# EAGLE design LF_mainboard (EAGLE 9.6.2)
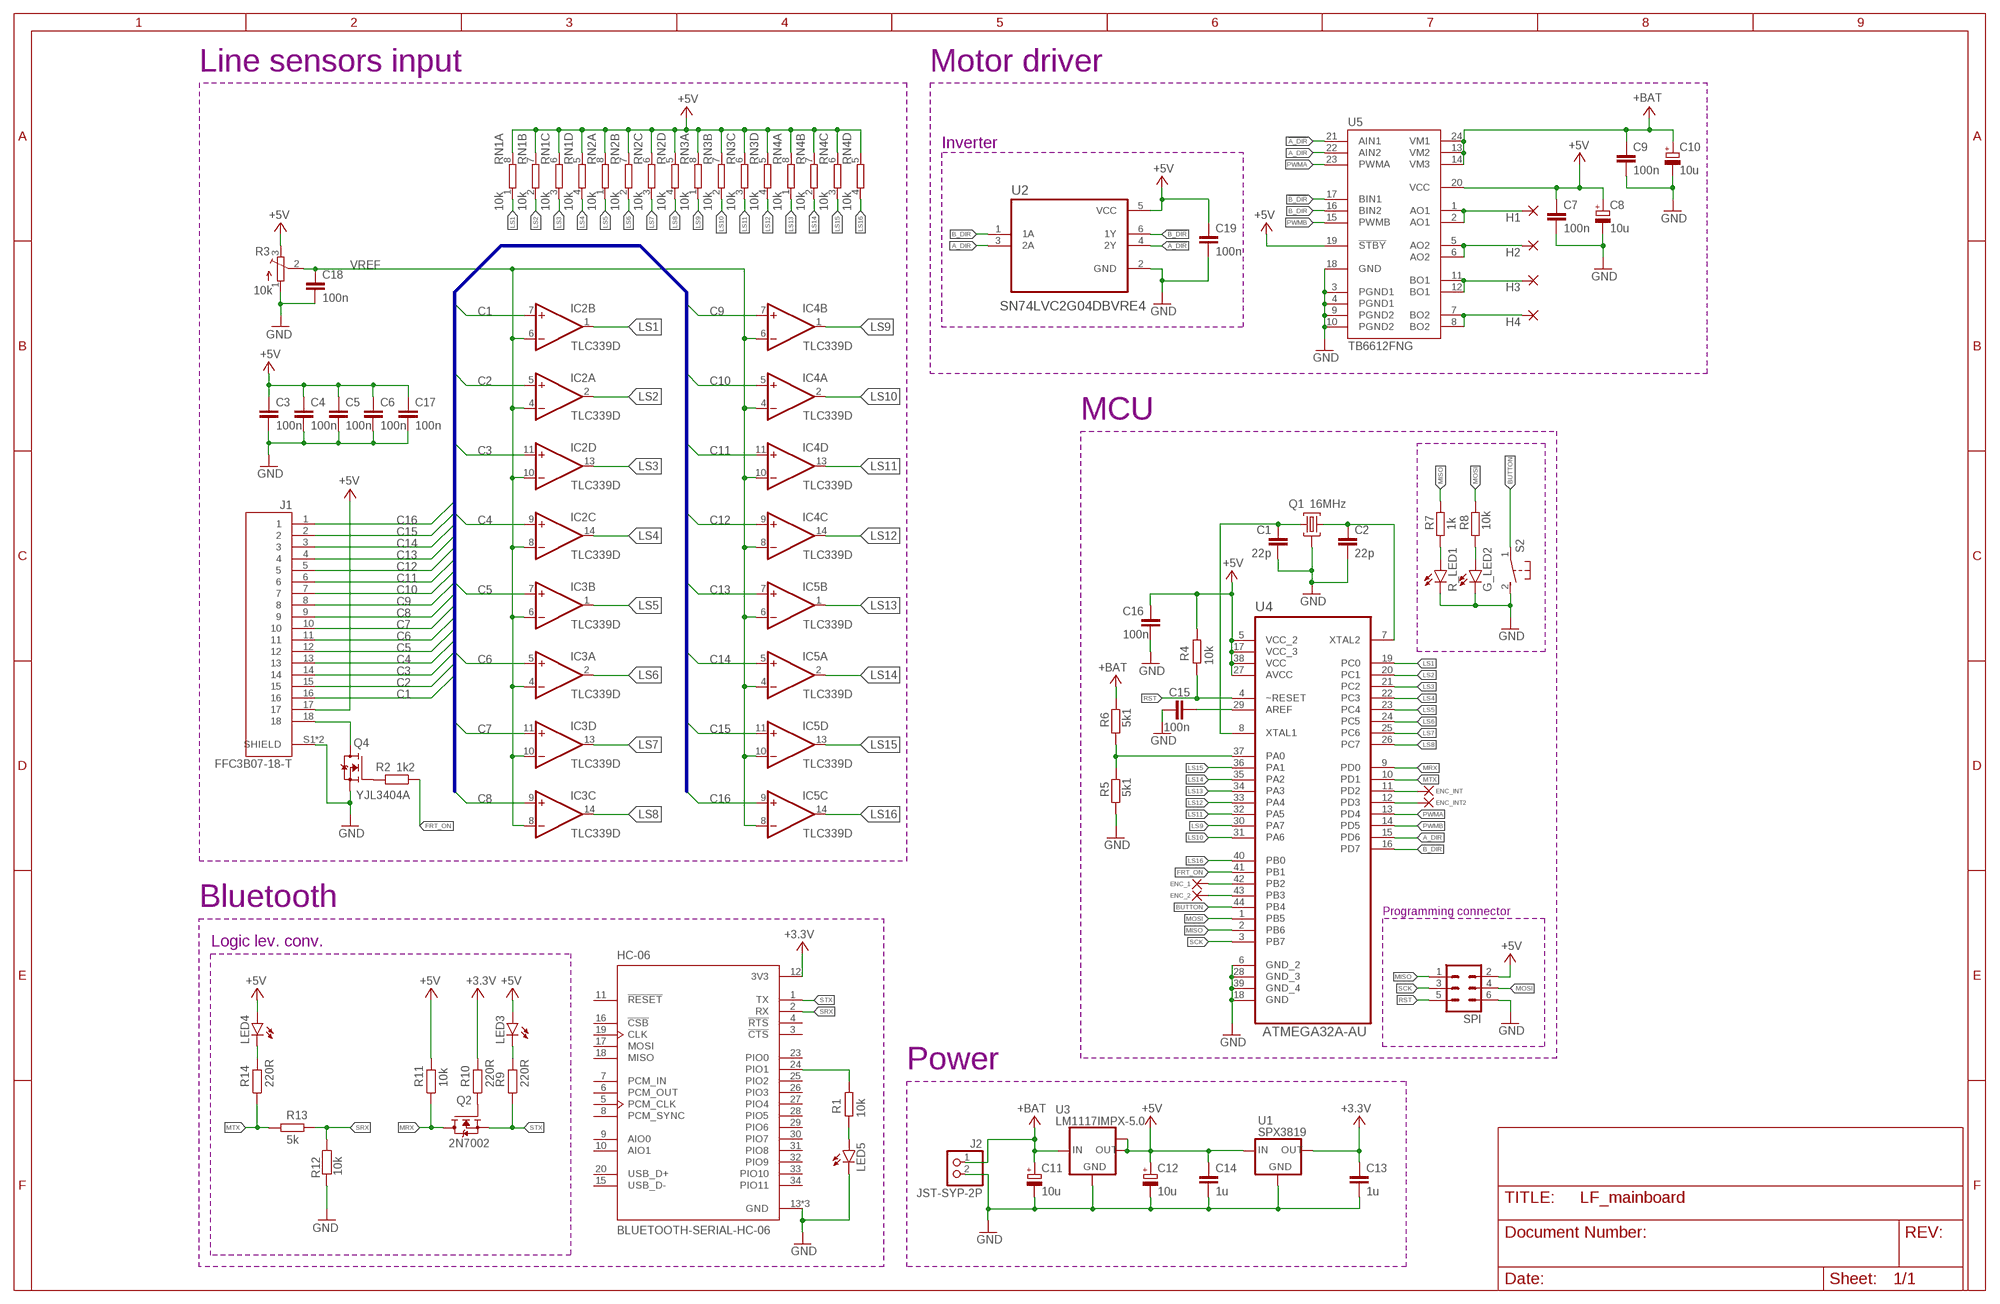
[diagram p0: schematic, sheet 1]

## Parts
C1  22p  C-EUC0603  [C0603]
C2  22p  C-EUC0603  [C0603]
C3  100n  C-EUC0603  [C0603]
C4  100n  C-EUC0603  [C0603]
C5  100n  C-EUC0603  [C0603]
C6  100n  C-EUC0603  [C0603]
C7  100n  C-EUC0603  [C0603]
C8  10u  CPOL-EUB/3528-21W  [B/3528-21W]
C9  100n  C-EUC0603  [C0603]
C10  10u  CPOL-EUB/3528-21W  [B/3528-21W]
C11  10u  CPOL-EUB/3528-21W  [B/3528-21W]
C12  10u  CPOL-EUB/3528-21W  [B/3528-21W]
C13  1u  C-EUC0805  [C0805]
C14  1u  C-EUC0805  [C0805]
C15  100n  C-EUC0603  [C0603]
C16  100n  C-EUC0402  [C0402]
C17  100n  C-EUC0603  [C0603]
C18  100n  C-EUC0402  [C0402]
C19  100n  C-EUC0402  [C0402]
ENC_2  1,6/0,8  [1,6/0,8]
G_LED2  LEDCHIP-LED0805  [CHIP-LED0805]
H1  1,6/0,8  [1,6/0,8]
H2  1,6/0,8  [1,6/0,8]
H3  1,6/0,8  [1,6/0,8]
H4  1,6/0,8  [1,6/0,8]
H5  1,6/0,8  [1,6/0,8]
H6  1,6/0,8  [1,6/0,8]
H8  1,6/0,8  [1,6/0,8]
HC-06  BLUETOOTH-SERIAL-HC-06  [XCVR_BLUETOOTH-SERIAL-HC-06]
IC2  TLC339D  [SO14]
IC3  TLC339D  [SO14]
IC4  TLC339D  [SO14]
IC5  TLC339D  [SO14]
J1  FFC3B07-18-T  [GCT_FFC3B07-18-T]
J2  JST-SYP-2P  PINHD-1X2  [1X02]
LED3  LEDCHIP-LED0805  [CHIP-LED0805]
LED4  LEDCHIP-LED0805  [CHIP-LED0805]
LED5  LEDCHIP-LED0805  [CHIP-LED0805]
Q1  16MHz  CRYSTAL_3,4X2,7  [CRYSTAL_3,4X2,7]
Q2  2N7002  [SOT95P240X111-3N]
Q4  YJL3404A  2N7002  [SOT95P240X111-3N]
R1  10k  R-EU_R0603  [R0603]
R2  1k2  R-EU_R0603  [R0603]
R3  10k  TRIM_EU-SM-42/43A  [SM-42/43A]
R4  10k  R-EU_R0402  [R0402]
R5  5k1  R-EU_R0603  [R0603]
R6  5k1  R-EU_R0603  [R0603]
R7  1k  R-EU_R0402  [R0402]
R8  10k  R-EU_R0402  [R0402]
R9  220R  R-EU_R0402  [R0402]
R10  220R  R-EU_R0402  [R0402]
R11  10k  R-EU_R0402  [R0402]
R12  10k  R-EU_R0402  [R0402]
R13  5k  R-EU_R0402  [R0402]
R14  220R  R-EU_R0402  [R0402]
R_LED1  LEDCHIP-LED0805  [CHIP-LED0805]
RN1  10k  4R-NCAT16  [CAT16]
RN2  10k  4R-NCAT16  [CAT16]
RN3  10k  4R-NCAT16  [CAT16]
RN4  10k  4R-NCAT16  [CAT16]
S2  DTSM-3  [DTSM-3]
SPI  MA03-2  [MA03-2]
U1  SPX3819  [SOT23-5]
U2  SN74LVC2G04DBVRE4  [SOT95P280X145-6N]
U3  LM1117IMPX-5.0  [SOT223]
U4  ATMEGA32A-AU  [QFP80P1200X1200X120-44N]
U5  TB6612FNG  [SSOP24]

## Nets
!A_DIR: U2.4(2Y) U5.21(AIN1)
!B_DIR: U2.6(1Y) U5.17(BIN1)
+3.3V: C13.1 HC-06.12(3V3) R10.2 U1.5(OUT) ; supply symbol labelled VCC
+5V: C3.1 C4.1 C5.1 C6.1 C7.1 C8.+ C12.+ C14.1 C16.1 C17.1 C19.1 J1.17 LED3.A LED4.A R3.3(E) R4.2 R11.2 RN1.5 RN1.6 RN1.7 RN1.8 RN2.5 RN2.6 RN2.7 RN2.8 RN3.5 RN3.6 RN3.7 RN3.8 RN4.5 RN4.6 RN4.7 RN4.8 SPI.2 U1.1(IN) U1.3(IN) U2.5(VCC) U3.2(OUT) U3.TAB(OUT1) U4.5(VCC_2) U4.17(VCC_3) U4.27(AVCC) U4.38(VCC) U5.19(!STBY) U5.20(VCC) ; supply symbol labelled VCC
+BAT: C9.1 C10.+ C11.+ J2.1 R6.2 U3.3(IN) U5.13(VM2) U5.14(VM3) U5.24(VM1) ; supply symbol labelled VCC
A_DIR: U2.3(2A) U4.15(PD6) U5.22(AIN2)
AO: H1.1(P) U5.1(AO1) U5.2(AO1)
AO2: H2.1(P) U5.5(AO2) U5.6(AO2)
AREF: C15.2 U4.29(AREF)
B_DIR: U2.1(1A) U4.16(PD7) U5.16(BIN2)
BAT_MEAS: R5.2 R6.1 U4.37(PA0)
BO1: H3.1(P) U5.11(BO1) U5.12(BO1)
BO2: H4.1(P) U5.7(BO2) U5.8(BO2)
BUTTON: S2.1 U4.44(PB4)
C1: IC2.7(B:+IN) J1.16
C2: IC2.5(A:+IN) J1.15
C3: IC2.11(D:+IN) J1.14
C4: IC2.9(C:+IN) J1.13
C5: IC3.7(B:+IN) J1.12
C6: IC3.5(A:+IN) J1.11
C7: IC3.11(D:+IN) J1.10
C8: IC3.9(C:+IN) J1.9
C9: IC4.7(B:+IN) J1.8
C10: IC4.5(A:+IN) J1.7
C11: IC4.11(D:+IN) J1.6
C12: IC4.9(C:+IN) J1.5
C13: IC5.7(B:+IN) J1.4
C14: IC5.5(A:+IN) J1.3
C15: IC5.11(D:+IN) J1.2
C16: IC5.9(C:+IN) J1.1
ENC_1: H8.1(P) U4.42(PB2)
ENC_2: ENC_2.1(P) U4.43(PB3)
ENC_INT: H5.1(P) U4.11(PD2)
ENC_INT2: H6.1(P) U4.12(PD3)
FRT_ON: R2.1 U4.41(PB1)
GND: C1.2 C2.2 C3.2 C4.2 C5.2 C6.2 C7.2 C8.- C9.2 C10.- C11.- C12.- C13.2 C14.2 C15.1 C16.2 C17.2 C18.2 C19.2 G_LED2.C HC-06.13(GND) HC-06.21(GND) HC-06.22(GND) J1.S1(SHIELD) J1.S2(SHIELD) J2.2 LED5.C Q1.GND Q1.GND2 Q4.2(S) R3.1(A) R5.1 R12.2 R_LED1.C S2.2 SPI.6 U1.2(GND) U2.2(GND) U3.1(GND) U4.6(GND_2) U4.18(GND) U4.28(GND_3) U4.39(GND_4) U5.3(PGND1) U5.4(PGND1) U5.9(PGND2) U5.10(PGND2) U5.18(GND)
LED1: R7.1 R_LED1.A
LED2: G_LED2.A R8.1
LS1: IC2.1(B:OUT) RN1.1 U4.19(PC0)
LS2: IC2.2(A:OUT) RN1.2 U4.20(PC1)
LS3: IC2.13(D:OUT) RN1.3 U4.21(PC2)
LS4: IC2.14(C:OUT) RN1.4 U4.22(PC3)
LS5: IC3.1(B:OUT) RN2.1 U4.23(PC4)
LS6: IC3.2(A:OUT) RN2.2 U4.24(PC5)
LS7: IC3.13(D:OUT) RN2.3 U4.25(PC6)
LS8: IC3.14(C:OUT) RN2.4 U4.26(PC7)
LS9: IC4.1(B:OUT) RN3.1 U4.30(PA7)
LS10: IC4.2(A:OUT) RN3.2 U4.31(PA6)
LS11: IC4.13(D:OUT) RN3.3 U4.32(PA5)
LS12: IC4.14(C:OUT) RN3.4 U4.33(PA4)
LS13: IC5.1(B:OUT) RN4.1 U4.34(PA3)
LS14: IC5.2(A:OUT) RN4.2 U4.35(PA2)
LS15: IC5.13(D:OUT) RN4.3 U4.36(PA1)
LS16: IC5.14(C:OUT) RN4.4 U4.40(PB0)
MISO: R7.2 SPI.1 U4.2(PB6)
MOSI: R8.2 SPI.4 U4.1(PB5)
MRX: Q2.3(D) R11.1 U4.9(PD0)
MTX: R13.1 R14.1 U4.10(PD1)
N$1: C1.1 Q1.CRST1 U4.8(XTAL1)
N$2: C2.1 Q1.CRST2 U4.7(XTAL2)
N$4: J1.18 Q4.3(D)
N$7: Q4.1(G) R2.2
N$8: HC-06.24(PIO1) R1.2
N$9: Q2.1(G) R10.1
N$10: LED4.C R14.2
N$11: LED3.C R9.2
N$12: LED5.A R1.1
PWMA: U4.13(PD4) U5.23(PWMA)
PWMB: U4.14(PD5) U5.15(PWMB)
RST: R4.1 SPI.5 U4.4(~RESET)
SCK: SPI.3 U4.3(PB7)
SRX: HC-06.2(RX) R12.1 R13.2
STX: HC-06.1(TX) Q2.2(S) R9.1
VREF: C18.1 IC2.4(A:-IN) IC2.6(B:-IN) IC2.8(C:-IN) IC2.10(D:-IN) IC3.4(A:-IN) IC3.6(B:-IN) IC3.8(C:-IN) IC3.10(D:-IN) IC4.4(A:-IN) IC4.6(B:-IN) IC4.8(C:-IN) IC4.10(D:-IN) IC5.4(A:-IN) IC5.6(B:-IN) IC5.8(C:-IN) IC5.10(D:-IN) R3.2(S)
Unconnected: HC-06.3(!CTS) HC-06.4(!RTS) HC-06.5(PCM_CLK) HC-06.6(PCM_OUT) HC-06.7(PCM_IN) HC-06.8(PCM_SYNC) HC-06.9(AIO0) HC-06.10(AIO1) HC-06.11(!RESET) HC-06.15(USB_D-) HC-06.16(!CSB) HC-06.17(MOSI) HC-06.18(MISO) HC-06.19(CLK) HC-06.20(USB_D+) HC-06.23(PIO0) HC-06.25(PIO2) HC-06.26(PIO3) HC-06.27(PIO4) HC-06.28(PIO5) HC-06.29(PIO6) HC-06.30(PIO7) HC-06.31(PIO8) HC-06.32(PIO9) HC-06.33(PIO10) HC-06.34(PIO11)

## Buses
C[1..16]

## Notes on the sheet
- Line sensors input | Motor driver
- Inverter
- MCU
- Bluetooth
- Programming connector
- Logic lev. conv.
- Power

## Power pins joined to a net without a drawn wire
+5V: IC2.3(P:V+) IC3.3(P:V+) IC4.3(P:V+) IC5.3(P:V+)
GND: IC2.12(P:V-) IC3.12(P:V-) IC4.12(P:V-) IC5.12(P:V-)

## Library data of the parts
C1-C7 C9 C13-C19 = rcl:C-EU: CAPACITOR, European symbol; SPICEPREFIX: C
C8 C10-C12 = rcl:CPOL-EU: POLARIZED CAPACITOR, European symbol; SPICEPREFIX: C
ENC_2 H1-H6 H8 = wirepad:1,6/0,8: THROUGH-HOLE PAD
G_LED2 LED3-LED5 R_LED1 = led:LED: LED OSRAM: - CHIPLED LG R971, LG N971, LY N971, LG Q971, LY Q971, LO R971, LY R971 LH N974, LH R974 LS Q976, LO Q976, LY Q976 LO Q996 - Hyper CHIPLED LW Q18S LB Q993, LB Q99A, LB R99A - SideLED LS A670, LO A670, LY A670, LG A670, LP A670 LB A673, LV A673, LT A673, LW A673 LH A674 LY A675 LS A676, LA A676, LO A676, LY A676, LW A676 LS A679, LY A679, LG A679 - Hyper Micro SIDELED® LS Y876, LA Y876, LO Y876, LY Y876 LT Y87S - SmartLED LW L88C, LW L88S LB L89C, LB L89S, LG L890 LS L89K, LO L89K, LY L89K LS L896, LA L896, LO L896, LY L896 - TOPLED LS T670, LO T670, LY T670, LG T670, LP T670 LSG T670, LSP T670, LSY T670, LOP T670, LYG T670 LG T671, LOG T671, LSG T671 LB T673, LV T673, LT T673, LW T673 LH T674 LS T676, LA T676, LO T676, LY T676, LB T676, LH T676, LSB T676, LW T676 LB T67C, LV T67C, LT T67C, LS T67K, LO T67K, LY T67K, LW E67C LS E67B, LA E67B, LO E67B, LY E67B, LB E67C, LV E67C, LT E67C LW T67C LS T679, LY T679, LG T679 LS T770, LO T770, LY T770, LG T770, LP T770 LB T773, LV T773, LT T773, LW T773 LH T774 LS E675, LA E675, LY E675, LS T675 LS T776, LA T776, LO T776, LY T776, LB T776 LHGB T686 LT T68C, LB T68C - Hyper Mini TOPLED® LB M676 - Mini TOPLED Santana® LG M470 LS M47K, LO M47K, LY M47K Source: http://www.osram.convergy.de LUXEON: - LUMILED® LXK2-PW12-R00, LXK2-PW12-S00, LXK2-PW14-U00, LXK2-PW14-V00 LXK2-PM12-R00, LXK2-PM12-S00, LXK2-PM14-U00 LXK2-PE12-Q00, LXK2-PE12-R00, LXK2-PE12-S00, LXK2-PE14-T00, LXK2-PE14-U00 LXK2-PB12-K00, LXK2-PB12-L00, LXK2-PB12-M00, LXK2-PB14-N00, LXK2-PB14-P00, LXK2-PB14-Q00 LXK2-PR12-L00, LXK2-PR12-M00, LXK2-PR14-Q00, LXK2-PR14-R00 LXK2-PD12-Q00, LXK2-PD12-R00, LXK2-PD12-S00 LXK2-PH12-R00, LXK2-PH12-S00 LXK2-PL12-P00, LXK2-PL12-Q00, LXK2-PL12-R00 Source: www.luxeon.com KINGBRIGHT: KA-3528ASYC Source: www.kingbright.com
HC-06 = BLUETOOTH-SERIAL-HC-06:BLUETOOTH-SERIAL-HC-06: Bluetooth Modules (802.15.1) BLUETOOTH-SERIAL-HC-06 Check availability <https://pricing.snapeda.com/parts/BLUETOOTH-SERIAL-HC-06/Olimex/view-part?ref=eda>; AVAILABILITY: In Stock; DESCRIPTION: Bluetooth Modules (802.15.1) BLUETOOTH-SERIAL-HC-06; MF: Olimex; MP: BLUETOOTH-SERIAL-HC-06; PACKAGE: None; PRICE: None; PURCHASE-URL: https://pricing.snapeda.com/search/part/BLUETOOTH-SERIAL-HC-06/?ref=eda
IC2-IC5 = linear:TLC339: COMPARATOR
J1 = FFC18T_1mm:FFC3B07-18-T: FPC 1.0mm Pitch, Side entry, Top contact, SMT, Height 2.5mm, Slide type; MANUFACTURER: GCT; MAXIMUM_PACKAGE_HEIGHT: 2.5mm; PARTREV: A; STANDARD: Manufacturer Recommendations
J2 = pinhead:PINHD-1X2: PIN HEADER
Q1 = CRYSTAL_SMD_3,4x2.7mm:CRYSTAL_3,4X2,7
Q2 Q4 = 2N7002:2N7002: N-Channel 60V 280mA (Ta) 350mW (Ta) Surface Mount SOT-23-3 (TO-236) Check availability <https://pricing.snapeda.com/parts/2N7002/ON%20Semiconductor/view-part?ref=eda>; AVAILABILITY: In Stock; DESCRIPTION: N-Channel 60V 280mA (Ta) 350mW (Ta) Surface Mount SOT-23-3 (TO-236); MF: ON Semiconductor; MP: 2N7002; PACKAGE: SOT-23-3 ON Semiconductor; PRICE: None; PURCHASE-URL: https://pricing.snapeda.com/search/part/2N7002/?ref=eda
R1 R2 R4-R14 = rcl:R-EU_: RESISTOR, European symbol; SPICEPREFIX: R
R3 = pot:TRIM_EU-: POTENTIOMETER
RN1-RN4 = resistor-dil:4R-N: Array Chip Resistor Source: RS Component / Phycomp; OC_FARNELL: unknown; OC_NEWARK: unknown
S2 = switch-tact:DTSM-3
SPI = con-lstb:MA03-2: PIN HEADER; OC_FARNELL: unknown; OC_NEWARK: unknown
U1 = SPX3819:SPX3819: Check availability <https://pricing.snapeda.com/parts/SPX3819/MaxLinear%2C%20Inc./view-part?ref=eda>; AVAILABILITY: In Stock; DESCRIPTION: Linear Voltage Regulator IC Positive Adjustable 1 Output 500mA 8-DFN (2x3); MF: MaxLinear, Inc.; MP: SPX3819; PACKAGE: SOT-23-5 Exar; PRICE: None; PURCHASE-URL: https://pricing.snapeda.com/search/part/SPX3819/?ref=eda
U2 = SN74LVC2G04DBVRE4:SN74LVC2G04DBVRE4: Check availability <https://pricing.snapeda.com/parts/SN74LVC2G04DBVRE4/Texas%20Instruments/view-part?ref=eda>; AVAILABILITY: In Stock; CHECK_PRICES: https://www.snapeda.com/parts/SN74LVC2G04DBVRE4/Texas+Instruments/view-part/?ref=eda; DESCRIPTION: Dual Inverter 6-SOT-23 -40 to 125; MF: Texas Instruments; MP: SN74LVC2G04DBVRE4; PACKAGE: SOT-23-6 Texas Instruments; PRICE: None; PURCHASE-URL: https://www.snapeda.com/api/url_track_click_mouser/?unipart_id=1202060&manufacturer=Texas Instruments&part_name=SN74LVC2G04DBVRE4&search_term=sn74lvc2g04; SNAPEDA_LINK: https://www.snapeda.com/parts/SN74LVC2G04DBVRE4/Texas+Instruments/view-part/?ref=snap
U3 = lm1117:LM1117IMPX-*
U4 = ATMEGA32A-AU:ATMEGA32A-AU: 8-bit Microcontroller Check availability <https://pricing.snapeda.com/parts/ATMEGA32A-AU/Microchip%20Technology/view-part?ref=eda>; AVAILABILITY: In Stock; DESCRIPTION: AVR AVR® ATmega Microcontroller IC 8-Bit 16MHz 32KB (16K x 16) FLASH 44-TQFP (10x10); MF: Microchip Technology; MP: ATMEGA32A-AU; PACKAGE: TQFP-44 Microchip; PRICE: None; PURCHASE-URL: https://pricing.snapeda.com/search/part/ATMEGA32A-AU/?ref=eda
U5 = tb6612:TB6612FNG

## Board
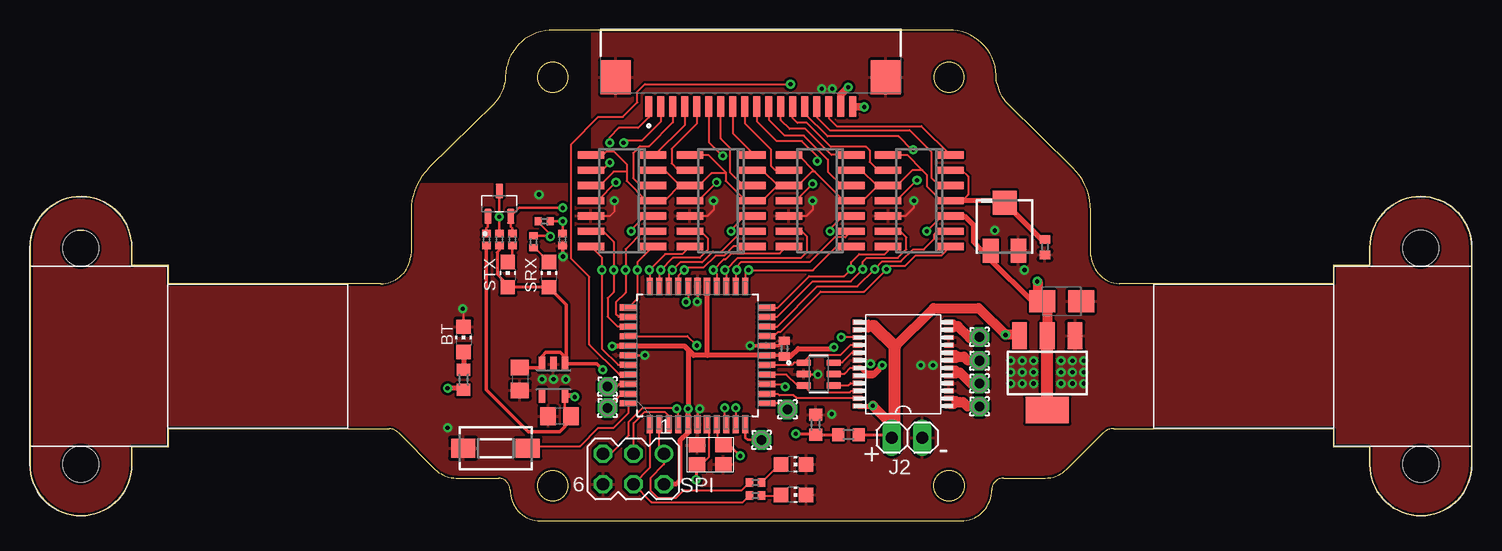
[diagram p1: board, top side]
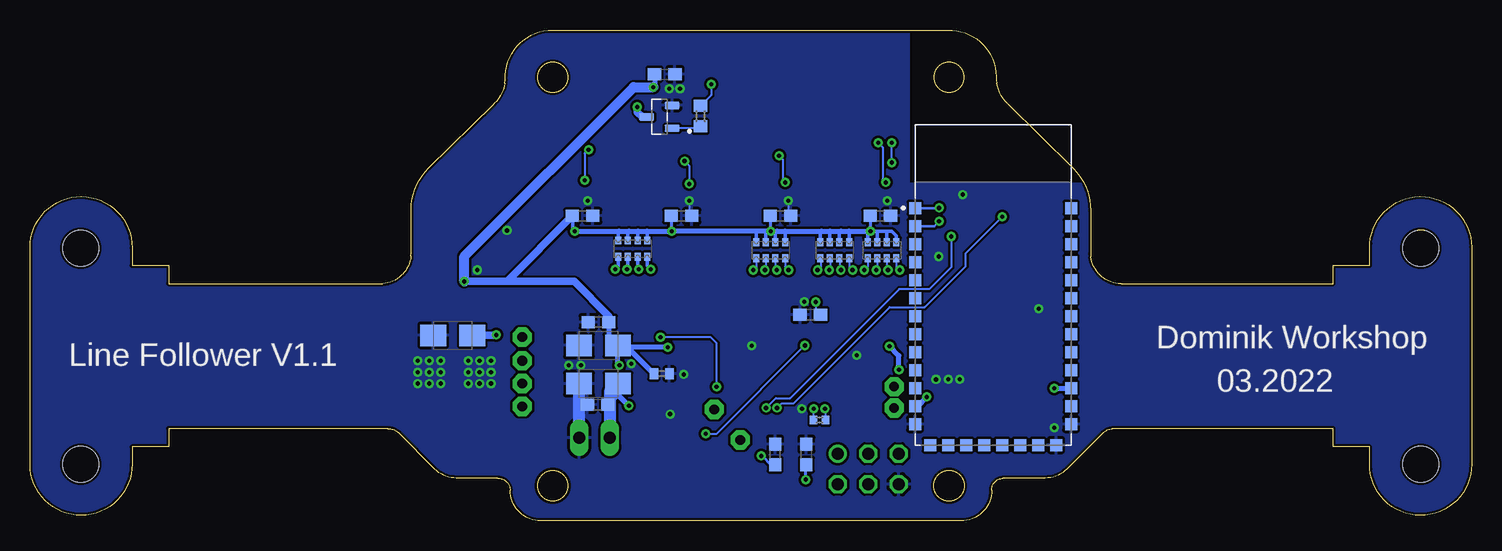
[diagram p2: board, bottom side, seen from below]

Size 120.14 x 40.89 mm. Coordinates in mm from the lower left corner, seen from the top.
Outline: 3.97,24.19 4.08,24.21 4.18,24.22 4.29,24.22 4.4,24.21 4.5,24.19
Outline: 29.22,19.75 11.56,19.75 11.56,21.27 8.51,21.27 8.51,22.73 8.5,23.1 arc175 0,22.8 0,4.7 arc175 8.49,4.33 8.51,4.7 8.51,6.16 11.56,6.16 11.56,7.68 29.83,7.68 29.94,7.68 arc-40 30.72,7.31 33.74,4.3 arc45 35.53,3.56 38.99,3.56 39.08,3.55 arc-85 40,2.54 40.02,2.32 arc85 42.55,0 77.6,0 77.82,0.01 arc80 80.13,2.32 80.14,2.54 arc-90 81.15,3.56 84.61,3.56 84.83,3.57 arc40 86.41,4.3 89.42,7.31 89.5,7.39 arc-40 90.31,7.68 108.59,7.68 108.59,6.16 111.63,6.16 111.63,4.7 111.65,4.33 arc175 120.14,4.7 120.14,22.8 120.12,23.17 arc175 111.63,22.73 111.63,21.27 108.59,21.27 108.59,19.75 90.92,19.75 90.76,19.75 arc-45 89.04,20.6 89.02,20.63 88.98,20.67 arc-35 88.4,22.06 88.39,22.28 88.39,25.84 arc45 86.9,29.41 81.47,34.75 81.45,34.77 arc-35 80.57,36.47 80.53,36.74 arc93 76.58,40.89 43.56,40.89 43.28,40.88 arc85 39.62,37.02 39.62,36.99 39.61,36.72 39.57,36.44 arc-35 38.67,34.75 33.24,29.41 33.21,29.38 arc45 31.75,25.84 31.75,22.28 31.75,22.22 31.73,22 arc-35 31.13,20.63 31.1,20.6 30.99,20.48 arc-45 29.22,19.75
Outline: circle at 43.56,2.92 radius 1.27
Outline: circle at 76.58,2.92 radius 1.27
Outline: circle at 76.58,36.96 radius 1.25
Outline: circle at 43.56,36.96 radius 1.25
Copper layers (1*16): Top 0.035mm / dielectric 1.5mm / Bottom 0.035mm
Design rules "default *": minimum track width 6mil, minimum drill 0.35mm, track to track 6mil, track to pad 6mil, pad to pad 6mil, via to via 6mil, smd to smd 6mil, copper to edge 4mil, drill to drill 6mil, minimum pad ring 10mil, minimum via ring 8mil, stop-mask expansion 4mil, vias tented up to drill 14mil, thermal gap 10mil

### Footprints (pad centres in the part's own frame; a part is rotated, then mirrored left to right if it is on the bottom)
C0603 = smd 1.1 x 1: 1 -0.85,0; 2 0.85,0
B/3528-21W = smd 2.15 x 1.8: + 1.625,0; - -1.625,0
C0805 = smd 1.3 x 1.5: 1 -0.95,0; 2 0.95,0
C0402 = smd 0.7 x 0.9: 1 -0.65,0; 2 0.65,0
1,6/0,8 = drill 0.813 pad 1.6 octagon: 1 0,0
CHIP-LED0805 = smd 1.2 x 1.2: A 0,-1.05; C 0,1.05
XCVR_BLUETOOTH-SERIAL-HC-06 = smd 1 x 1: 1 -6.5,6.5; 2 -6.5,5; 3 -6.5,3.5; 4 -6.5,2; 5 -6.5,0.5; 6 -6.5,-1; 7 -6.5,-2.5; 8 -6.5,-4; 9 -6.5,-5.5; 10 -6.5,-7; 11 -6.5,-8.5; 12 -6.5,-10; 13 -6.5,-11.5; 14 -5.25,-13.25; 15 -3.75,-13.25; 16 -2.25,-13.25; 17 -0.75,-13.25; 18 0.75,-13.25; 19 2.25,-13.25; 20 3.75,-13.25; 21 5.25,-13.25; 22 6.5,-11.5; 23 6.5,-10; 24 6.5,-8.5; 25 6.5,-7; 26 6.5,-5.5; 27 6.5,-4; 28 6.5,-2.5; 29 6.5,-1; 30 6.5,0.5; 31 6.5,2; 32 6.5,3.5; 33 6.5,5; 34 6.5,6.5
SO14 = smd 0.6 x 2.2: 1 -3.81,-2.6; 2 -2.54,-2.6; 3 -1.27,-2.6; 4 0,-2.6; 5 1.27,-2.6; 6 2.54,-2.6; 7 3.81,-2.6; 8 3.81,2.6; 9 2.54,2.6; 10 1.27,2.6; 11 0,2.6; 12 -1.27,2.6; 13 -2.54,2.6; 14 -3.81,2.6
GCT_FFC3B07-18-T = smd 0.6 x 1.7: 1 8.5,2.45; 2 7.5,2.45; 3 6.5,2.45; 4 5.5,2.45; 5 4.5,2.45; 6 3.5,2.45; 7 2.5,2.45; 8 1.5,2.45; 9 0.5,2.45; 10 -0.5,2.45; 11 -1.5,2.45; 12 -2.5,2.45; 13 -3.5,2.45; 14 -4.5,2.45; 15 -5.5,2.45; 16 -6.5,2.45; 17 -7.5,2.45; 18 -8.5,2.45 | smd 2.5 x 2.8: S1 11.25,0; S2 -11.25,0
1X02 = drill 1.016 long: 1 -1.27,0; 2 1.27,0
CRYSTAL_3,4X2,7 = smd 1.4 x 1.15: CRST1 0,-1.6; CRST2 2.2,0; GND 0,0; GND2 2.2,-1.6
SOT95P240X111-3N = smd 1.23 x 0.6: 1 -1.06,0.95; 2 -1.06,-0.95; 3 1.06,0
R0603 = smd 1 x 1.1: 1 -0.85,0; 2 0.85,0
SM-42/43A = smd 2 x 1.3: 1 2,1.15; 3 2,-1.15 | smd 2 x 2: 2 -2,0
R0402 = smd 0.6 x 0.7: 1 -0.5,0; 2 0.5,0
CAT16 = smd 0.5 x 0.65: 1 -1.2,-0.675; 2 -0.4,-0.675; 3 0.4,-0.675; 4 1.2,-0.675; 5 1.2,0.675; 6 0.4,0.675; 7 -0.4,0.675; 8 -1.2,0.675
DTSM-3 = smd 2 x 1.6: 1 -2.7,0; 2 2.7,0
MA03-2 = drill 1.016: 1 -2.54,-1.27 | drill 1.016 octagon: 2 -2.54,1.27; 3 0,-1.27; 4 0,1.27; 5 2.54,-1.27; 6 2.54,1.27
SOT23-5 = smd 1.2 x 0.55: 1 1.3,-0.95; 2 1.3,0; 3 1.3,0.95; 4 -1.3,0.95; 5 -1.3,-0.95
SOT95P280X145-6N = smd 1.21 x 0.58: 1 -1.255,0.95; 2 -1.255,0; 3 -1.255,-0.95; 4 1.255,-0.95; 5 1.255,0; 6 1.255,0.95
SOT223 = smd 1.219 x 2.235: 1 -2.311,-3.099; 2 0,-3.099; 3 2.311,-3.099 | smd 3.6 x 2.2: TAB 0,3.099
QFP80P1200X1200X120-44N = smd 1.473 x 0.508: 1 -5.74,3.988; 2 -5.74,3.2; 3 -5.74,2.388; 4 -5.74,1.6; 5 -5.74,0.787; 6 -5.74,0; 7 -5.74,-0.787; 8 -5.74,-1.6; 9 -5.74,-2.388; 10 -5.74,-3.2; 11 -5.74,-3.988; 23 5.74,-3.988; 24 5.74,-3.2; 25 5.74,-2.388; 26 5.74,-1.6; 27 5.74,-0.787; 28 5.74,0; 29 5.74,0.787; 30 5.74,1.6; 31 5.74,2.388; 32 5.74,3.2; 33 5.74,3.988 | smd 0.508 x 1.473: 12 -3.988,-5.74; 13 -3.2,-5.74; 14 -2.388,-5.74; 15 -1.6,-5.74; 16 -0.787,-5.74; 17 0,-5.74; 18 0.787,-5.74; 19 1.6,-5.74; 20 2.388,-5.74; 21 3.2,-5.74; 22 3.988,-5.74; 34 3.988,5.74; 35 3.2,5.74; 36 2.388,5.74; 37 1.6,5.74; 38 0.787,5.74; 39 0,5.74; 40 -0.787,5.74; 41 -1.6,5.74; 42 -2.388,5.74; 43 -3.2,5.74; 44 -3.988,5.74
SSOP24 = smd 0.406 x 0.762: 1 -3.651,-3.81; 2 -3.016,-3.81; 3 -2.381,-3.81; 4 -1.746,-3.81; 5 -1.111,-3.81; 6 -0.476,-3.81; 7 0.159,-3.81; 8 0.794,-3.81; 9 1.429,-3.81; 10 2.064,-3.81; 11 2.699,-3.81; 12 3.334,-3.81; 13 3.334,3.81; 14 2.699,3.81; 15 2.064,3.81; 16 1.429,3.81; 17 0.794,3.81; 18 0.159,3.81; 19 -0.476,3.81; 20 -1.111,3.81; 21 -1.746,3.81; 22 -2.381,3.81; 23 -3.016,3.81; 24 -3.651,3.81
HP_NM = hole 3: -9,-3; 9,-3

### Placement (x,y rotation side)
C1  58.04,5.52 90 bottom
C2  55.44,5.52 90 bottom
C3  49.28,25.4 0 bottom
C4  57.59,25.4 0 bottom
C5  65.85,25.4 0 bottom
C6  74.1,25.4 0 bottom
C7  72.77,16.54 180 bottom
C8  72.77,14.6 0 bottom
C9  72.83,9.65 180 bottom
C10  72.77,11.43 0 bottom
C11  84.91,15.44 0 bottom
C12  85.98,18.29 180 top
C13  44.13,8.7 180 top
C14  40.83,11.81 270 top
C15  55.12,17.18 0 bottom
C16  62.86,14.35 90 top
C17  67.25,37.21 0 bottom
C18  84.58,22.8 270 top
C19  67.5,12.26 0 bottom
ENC_2  48.13,9.4 0 top
G_LED2  63.63,2.16 270 top
H1  79.12,9.52 0 top
H2  79.12,11.43 0 top
H3  79.12,15.3 0 top
H4  79.12,13.33 0 top
H5  60.96,6.73 0 top
H6  63.12,9.27 0 top
H8  48.13,11.18 0 top
HC-06  39.88,19.56 0 bottom
IC2  74.1,26.67 90 top
IC3  65.85,26.67 90 top
IC4  57.59,26.67 90 top
IC5  49.34,26.67 90 top
J1  60.07,36.96 180 top
J2  73.09,6.92 0 top
LED3  39.81,20.51 0 top
LED4  43.24,20.51 0 top
LED5  36.13,15.11 0 top
Q1  57.78,4.7 180 top
Q2  39.12,26.42 90 top
Q4  67.69,33.66 180 bottom
R1  36.13,11.75 270 top
R2  64.26,33.72 270 bottom
R3  81.22,24.51 270 top
R4  54.36,8.38 180 bottom
R5  65.47,8 270 top
R6  68.21,7.18 0 top
R7  60.45,3.17 180 top
R8  60.45,2.1 180 top
R9  40.2,23.43 270 top
R10  38.04,23.43 270 top
R11  39.12,23.43 270 top
R12  44.39,23.43 270 top
R13  42.86,24.96 0 top
R14  41.97,23.24 270 top
R_LED1  63.63,4.7 270 top
RN1  69.91,22.67 0 bottom
RN2  58.42,22.54 0 bottom
RN3  53.09,22.54 0 bottom
RN4  49.15,22.54 0 bottom
S2  38.8,6.03 180 top
SPI  50.29,4.32 180 top
U1  43.62,11.75 90 top
U2  65.72,12.22 0 top
U3  84.77,12.32 180 top
U4  55.63,13.78 90 top
U5  72.77,13.21 90 top
U$1  [HP_NM]  112.9,13.72 90 top
U$2  [HP_NM]  7.24,13.72 270 top

### Tracks (layer width: path | path; a pad name or v marks a point on that pad's centre or on a via)
!A_DIR
  Top 0.152: U5.21 68.39,11.47 68.2,11.27 U2.4
!B_DIR
  Top 0.152: U5.17 68.5,14 67.7,13.21 67.01,13.21 U2.6
+3.3V  (via drill 0.35)
  Top 0.203: U1.5 44.57,10.41 44.57,9.21 C13.1
  Top 0.305: R10.2 38.04,10.92 41.53,7.43 44.13,7.43 45.08,8.38 C13.1
  Top 0.406: v45.4,10.32 45.31,10.41 44.57,10.41
  Bottom 0.406: HC-06.12 46.12,9.56 45.4,10.28 v45.4,10.32
+5V  (via drill 0.35, 0.35 pad 0.25)
  Top 0.152: IC5.3 51.24,25.4 50.1,24.26 v50.1,24.13 | IC4.3 59.56,25.4 58.42,24.26 v58.42,24.13 | IC3.3 67.75,25.4 66.67,24.32 v66.67,24.13 | IC2.3 76.01,25.4 v74.74,24.13 | LED3.A 39.81,19.65 | 62.79,13.78 C16.1 | U5.19 68.36,12.73 67.88,12.26 67.56,12.26 67.4,12.26 67.01,12.26 U2.5
  Top 0.254: 39.81,19.65 38.93,20.54 38.93,22.36 39.12,22.55 R11.2 | LED4.A LED3.A
  Top 0.305: U4.17 62.79,13.78 | v47.73,12.57 47.22,13.08 44.7,13.08 | 44.7,13.08 44.61,13.08 U1.1 44.57,13.65 44.2,14.03 42.99,14.03 42.67,13.72 U1.3 42.39,12.76 C14.1 | LED4.A 44.7,18 44.7,13.08
  Top 0.406: C12.+ 83.5,18.29 80.07,21.72 R3.3 79.37,22.51 78.61,23.27 78.61,24.64 77.85,25.4 IC2.3 | U5.20 70.29,12.1 70.77,12.57 70.77,12.7 v71.02,12.95 70.35,12.29 69.72,12.29 69.28,12.73 U5.19 | SPI.2 53.85,3.05 54.17,3.36 54.17,6.67 54.84,7.34 U4.5 v54.84,9.33 54.84,14.25 | C16.1 63.36,13.7 64.01,14.35 66.99,14.35 v66.99,14.45 | v48.51,14.54 48.54,14.57 U4.38 54.52,14.57 54.84,14.25 | 54.84,14.25 55.31,13.78 56.45,13.78 | U4.17 56.45,13.78 | U4.27 56.41,13.82 56.45,13.78
  Top 0.61: J1.17 67.57,35.5 v68.2,36.13
  Top 0.813: U3.2 84.77,17.87 C12.+ 83.97,18.67 83.97,19.91 v83.95,19.94
  Top 1.016: U3.TAB U3.2
  Bottom 0.152: 58.44,24.13 v58.42,24.13 | v54.84,9.33 54.86,9.32 R4.2
  Bottom 0.254: C3.1 50.13,24.51 50.1,24.49 v50.1,24.13 | C4.1 58.44,24.13 | v66.67,24.13 66.7,24.15 C5.1
  Bottom 0.305: v74.74,24.13 74.93,24.32 74.93,25.38 C6.1 | RN4.5 47.95,23.76 48.32,24.13 48.83,24.13 | 48.83,24.13 49.59,24.13 | 49.59,24.13 v50.1,24.13 | RN4.6 48.75,24.05 48.83,24.13 | RN4.7 49.55,24.09 49.59,24.13 | RN4.8 50.35,24.07 50.29,24.13 | RN3.5 51.89,24.12 51.88,24.13 | RN3.6 52.69,24.02 52.58,24.13 | RN3.7 53.49,24.11 53.47,24.13 | RN3.8 54.29,24.01 54.17,24.13 | RN2.5 57.22,24.12 57.21,24.13 | RN2.6 58.02,24.02 57.91,24.13 | RN2.7 58.82,24.11 58.8,24.13 | RN2.8 59.62,24.12 59.63,24.13 | RN1.5 68.71,24.12 68.71,24.13 | RN1.6 69.51,24.09 69.47,24.13 | RN1.7 70.31,24.05 70.23,24.13 | RN1.8 71.11,24.07 71.06,24.13
  Bottom 0.406: v50.1,24.13 50.29,24.13 51.88,24.13 52.58,24.13 53.47,24.13 54.17,24.13 57.21,24.13 57.91,24.13 v58.42,24.13 58.8,24.13 59.63,24.13 v66.67,24.13 68.71,24.13 69.47,24.13 70.23,24.13 71.06,24.13 v74.74,24.13 | C7.1 71.92,15.38 C8.+ | C19.1 70.53,14.64 70.98,14.64 71.02,14.6 C8.+ | v66.99,14.45 70.99,14.45 C8.+ | v71.02,12.95 71.15,13.08 C8.+ | 80.39,19.96 80.39,19.94 | v47.73,12.57 47.73,13.75 v48.51,14.54 | C17.1 68.1,36.23 v68.2,36.13
  Bottom 0.61: v83.95,19.94 80.39,19.94 74.8,19.94 71.92,17.06 C7.1 | C6.1 80.39,19.96
  Bottom 0.813: v83.95,19.94 83.95,22.03 69.84,36.13 v68.2,36.13
+BAT  (via drill 0.35, 0.35 pad 0.25)
  Top 0.203: 71.56,7.18 J2.1
  Top 0.254: R6.2 71.56,7.18
  Top 0.406: U5.24 70.2,9.56 v70.23,9.59 | U5.13 69.88,16.54 | 69.88,16.54 | U5.14 69.88,15.91 70.2,16.22 69.88,16.54
  Top 0.61: 82.4,15.48 U3.3
  Top 0.813: 72.07,14.48 75.31,17.72 79.06,17.72 v81.29,15.48 82.4,15.48 | v70.23,9.59 71.82,8 J2.1
  Top 1.016: 70.2,16.22 70.33,16.22 72.07,14.48 72.07,7.62 71.82,7.37 J2.1
  Bottom 0.406: C9.1 71.15,10.49 C10.+ 71.15,10.5 v70.23,9.59
  Bottom 0.61: C11.+ 81.33,15.44 v81.29,15.48
  Bottom 1.016: J2.1 71.82,10.76 C10.+
A_DIR
  Top 0.152: U4.15 63.04,12.18 63.95,11.27 U2.3 65.03,10.71 65.03,10.7 68.33,10.7 68.45,10.83 U5.22
AO
  Top 0.406: 77.22,9.87 77.34,9.75 77.28,9.75 77.09,9.56 U5.1 | 77.47,9.87 77.15,10.19 U5.2
  Top 0.813: 77.22,9.87 77.47,9.87 77.76,9.87 78.1,9.52 H1.1
AO2
  Top 0.406: U5.6 77.15,12.73 77.5,12.38 77.5,12.35 77.25,12.1 77.03,12.1 | U5.5 77.03,12.1 | 77.03,12.1 77.28,12.35
  Top 0.813: 77.28,12.35 77.5,12.35 78.42,11.43 H2.1
AREF  (via drill 0.35)
  Top 0.152: U4.29 54.84,18.39 v54.67,18.22
  Bottom 0.152: v54.67,18.22 54.67,17.58 C15.2
B_DIR
  Top 0.152: U5.16 68.37,14.64 67.58,13.84 65.06,13.84 64.47,13.25 U2.1 63.66,13.17 63.5,13.02 61.39,13.02 U4.16
BAT_MEAS  (via drill 0.35)
  Top 0.152: U4.37 54.79,15.38 v55.56,14.6 | 65.38,7.24 R5.2 | 67.33,7.15 R6.1
  Top 0.254: v63.82,7.24 65.38,7.24 | R5.2 67.33,7.15
  Bottom 0.152: v63.82,7.24 62.93,7.24 v55.56,14.6
BO1
  Top 0.406: U5.11 76.96,15.91 77.26,16.21 77.33,16.21 76.99,16.54 U5.12
  Top 0.813: 77.33,16.21 78.3,15.24 78.36,15.3 H3.1
BO2
  Top 0.406: U5.7 77.22,13.37 77.5,13.65 77.15,14 U5.8 77.03,14 77.34,13.68
  Top 0.813: 77.34,13.68 77.82,13.68 78.17,13.33 H4.1
BUTTON
  Top 0.152: S2.1 41.69,6.22 45.85,6.22 47.37,7.75 48.64,7.75 49.89,8.99 U4.44
C1
  Top 0.152: IC2.7 74.29,32.89 67.22,32.89 66.57,33.54 J1.16
C2
  Top 0.152: IC2.5 75.75,27.94 75.12,28.57 75.12,30.73 73.31,32.54 66.64,32.54 65.57,33.62 J1.15
C3  (via drill 0.35 pad 0.01)
  Top 0.152: v73.6,30.92 73.49,30.92 72.39,32.02 66.46,32.02 64.57,33.92 J1.14 | v73.91,28.38 72.2,26.67 IC2.11
  Bottom 0.152: v73.6,30.92 73.91,30.61 v73.91,28.38
C4
  Top 0.152: IC2.9 70.67,29.21 69.98,29.91 69.98,30.86 69.68,31.16 66.73,31.16 64.75,33.15 63.94,33.15 63.57,33.52 J1.13
C5
  Top 0.152: J1.12 62.57,33.38 63.3,32.65 64.62,32.65 66.79,30.48 IC3.7
C6
  Top 0.152: IC3.5 67.63,27.94 66.48,29.08 66.48,30.1 64.49,32.09 62.91,32.09 61.57,33.43 J1.11
C7  (via drill 0.35 pad 0.01)
  Top 0.152: v65.59,29.97 65.59,30.35 64.32,31.63 62.24,31.63 60.57,33.3 J1.10 | v65.22,28.07 63.82,26.67 IC3.11
  Bottom 0.152: v65.59,29.97 65.22,29.59 v65.22,28.07
C8
  Top 0.152: IC3.9 62.11,29.21 61.73,29.59 61.73,30.95 59.57,33.11 J1.9
C9
  Top 0.152: J1.8 58.57,32.29 60.19,30.67 IC4.7
C10
  Top 0.152: IC4.5 59.44,27.94 58.33,29.04 58.33,31.08 57.57,31.84 J1.7
C11  (via drill 0.35 pad 0.01)
  Top 0.152: v57.21,28.19 55.69,26.67 IC4.11 | J1.6 56.57,31.53 57.72,30.38 v57.72,30.42
  Bottom 0.152: v57.72,30.42 57.4,30.1 57.4,28.38 v57.21,28.19
C12
  Top 0.152: IC4.9 54.04,29.21 53.47,29.78 53.47,30.99 55.57,33.09 J1.5
C13
  Top 0.152: IC5.7 52.07,30.48 54.54,32.96 54.54,34.48 J1.4
C14
  Top 0.152: IC5.5 51.84,28.04 50.77,28.04 50.26,28.54 50.26,30.64 50.83,31.21 51.59,31.21 53.57,33.19 J1.3
C15  (via drill 0.35, 0.35 pad 0.01)
  Top 0.152: v48.83,28.19 47.31,26.67 IC5.11 | v49.47,31.5 49.47,31.66 50.97,31.66 52.57,33.27 J1.2
  Bottom 0.152: v48.83,28.19 49.08,28.45 49.08,31.12 v49.47,31.5
C16  (via drill 0.35, 0.35 pad 0.01)
  Top 0.152: 47.69,29.21 v48.32,29.84 | v48.32,31.5 48.32,31.97 49.08,32.73 50.68,32.73 51.57,33.62 J1.1
  Top 0.203: IC5.9 47.69,29.21
  Bottom 0.152: v48.32,29.84 v48.32,31.5
ENC_1
  Top 0.203: U4.42 49.12,11.39 48.91,11.18 H8.1
ENC_2
  Top 0.203: U4.43 49.31,10.58 ENC_2.1
ENC_INT
  Top 0.203: U4.11 59.61,6.93 59.82,6.73 H5.1
ENC_INT2
  Top 0.203: U4.12 62.6,9.79 H6.1
FRT_ON  (via drill 0.35)
  Top 0.152: v63.37,36.38 51.24,36.38 50.61,35.75 50.61,34.86 49.4,33.66 47.37,33.66 45.08,31.37 45.08,21.84 46.61,20.32 46.61,14.67 49.08,12.19 49.87,12.19 U4.41
  Bottom 0.152: v63.37,36.38 63.37,35.46 R2.1
GND  (via drill 0.35)
  Top 0.152: IC5.12 48.34,25.4 48.7,25.77 v48.7,26.67 | v56.96,26.67 56.96,25.9 56.46,25.4 IC4.12 | IC3.12 64.72,25.4 65.22,25.9 v65.22,26.67 | IC2.12 72.97,25.4 73.66,26.09 v73.66,26.67 | U5.18 69.75,13.37 v70.04,13.08 | U4.39 v51.24,13.78 | v55.82,9.33 55.63,9.14 U4.6 | U4.28 55.63,18.26 v55.62,18.25 | v60.01,14.57 | LED5.C 36.13,17.59 v36.07,17.65 | U2.2 64.5,12.19 v65.66,12.19
  Top 0.305: C16.2 62.43,14.57 U4.18 v60.01,14.57 | R12.2 44.41,22.9 v44.41,22.02
  Bottom 0.152: v56.96,26.67 56.96,25.41 C4.2 | v65.22,26.67 65.22,25.41 C5.2
  Bottom 1.016: J2.2 74.36,11.39 C10.-
  other vias: 86.87,11.43 85.92,11.43 86.87,12.38 87.82,11.43 87.82,13.33 87.82,12.38 85.92,12.38 86.87,13.33 85.92,13.33 83.63,11.43 83.63,12.38 83.63,13.33 82.68,12.38 82.68,11.43 81.72,11.43 81.72,12.38 82.68,13.33 81.72,13.33 42.67,11.79 43.62,11.79 44.64,11.77 75.25,12.95 74.23,12.95 80.39,24.19 82.87,20.89 65.98,36 66.87,36 34.8,7.75 42.42,27.18 66.8,8.89
  pour Top (isolate 0.203): -0.25,-0.64 120.4,-0.64 120.4,41.08 -0.25,41.08
  pour Bottom (isolate 0.203): 120.4,41.27 -0.25,41.27 -0.25,-0.44 120.4,-0.44
  cutout Bottom (isolate 0.076, rank 2): 32,28.19 46.74,28.19 46.74,41.02 41.66,41.02 32,31.37
  cutout Top: 31.88,28.19 46.74,28.19 46.74,41.15 41.66,41.15 41.53,41.02 31.88,31.37 31.88,31.24
LED1
  Top 0.152: R_LED1.A 62.48,4.7 R7.1
LED2
  Top 0.152: R8.1 62.51,2.1 G_LED2.A
LS1  (via drill 0.35 pad 0.25)
  Top 0.152: IC2.1 75.94,22.1 73.79,22.1 72.9,21.21 71.63,21.21 v71.37,20.95 71.31,20.89 | U4.19 61.99,15.38 62.36,15.75 62.55,15.75 65.89,19.09 69.51,19.09 71.31,20.89 | 71.31,20.89
  Bottom 0.305: RN1.1 71.11,21.22 v71.37,20.95
LS2  (via drill 0.35 pad 0.25)
  Top 0.152: IC2.2 75.63,24.13 75.37,23.87 75.37,23.49 74.49,22.61 73.59,22.61 72.58,21.6 71.04,21.6 v70.39,20.95 68.96,19.52 65.62,19.52 62.27,16.17 U4.20
  Bottom 0.305: RN1.2 70.31,21.03 v70.39,20.95
LS3  (via drill 0.35 pad 0.25)
  Top 0.152: IC2.13 72.52,24.13 73.03,23.62 73.03,22.61 72.33,21.91 69.72,21.91 69.41,21.59 v69.41,20.95 68.4,19.95 65.23,19.95 62.25,16.98 U4.21
  Bottom 0.305: RN1.3 69.51,21.06 v69.41,20.95
LS4  (via drill 0.35 pad 0.25)
  Top 0.152: U4.22 62.32,17.77 64.94,20.38 67.85,20.38 v68.42,20.95 68.42,21.56 69.09,22.23 71.25,22.23 71.5,22.48 IC2.14
  Bottom 0.305: RN1.4 68.71,21.25 v68.42,20.95
LS5  (via drill 0.35 pad 0.25)
  Top 0.152: IC3.1 67.24,22.86 65.28,20.89 v59.88,20.89 59.61,20.62 U4.23
  Bottom 0.152: RN2.1 59.62,21.15 v59.88,20.89
LS6  (via drill 0.35 pad 0.25)
  Top 0.152: IC3.2 67.94,23.62 67.06,23.62 64.99,21.56 59.28,21.56 58.9,21.18 v58.9,20.89 58.83,20.82 U4.24
  Bottom 0.152: RN2.2 58.82,20.97 v58.9,20.89
LS7  (via drill 0.35 pad 0.25)
  Top 0.152: IC3.13 64.33,24.13 64.77,23.69 64.77,22.42 64.26,21.91 58.99,21.91 57.98,20.89 v57.91,20.89 58.01,20.79 U4.25
  Bottom 0.152: RN2.3 58.02,21 v57.91,20.89
LS8  (via drill 0.35 pad 0.25)
  Top 0.152: IC3.14 63.06,22.86 62.49,22.29 58.47,22.29 57.97,21.79 57.83,21.79 v56.93,20.89 57.23,20.59 U4.26
  Bottom 0.152: RN2.4 57.22,21.18 v56.93,20.89
LS9  (via drill 0.35 pad 0.25)
  Top 0.152: U4.30 54.03,20.41 v54.51,20.89 54.7,21.08 56.12,21.08 57.14,22.1 57.85,22.1 58.61,22.86 IC4.1
  Bottom 0.152: RN3.1 54.25,21.84 54.25,21.15 v54.51,20.89
LS10  (via drill 0.35 pad 0.25)
  Top 0.152: U4.31 53.24,20.59 v53.54,20.89 54.19,21.54 56.02,21.54 56.9,22.42 57.59,22.42 59.31,24.13 60.13,24.13
  Top 0.203: IC4.2 60.13,24.13
  Bottom 0.152: RN3.2 53.45,21.84 53.45,20.98 v53.54,20.89
LS11  (via drill 0.35 pad 0.25)
  Top 0.152: IC4.13 55.88,24.13 56.52,23.49 56.52,22.61 55.82,21.91 53.58,21.91 v52.57,20.89 52.43,20.75 U4.32
  Bottom 0.152: RN3.3 52.65,21.84 52.65,20.98 v52.57,20.89
LS12  (via drill 0.35 pad 0.25)
  Top 0.152: IC4.14 54.36,22.23 52.93,22.23 v51.59,20.89 51.64,20.85 U4.33
  Bottom 0.152: RN3.4 51.85,21.84 51.85,21.15 v51.59,20.89
LS13  (via drill 0.35 pad 0.25)
  Top 0.152: U4.34 50.61,18.49 v50.61,20.89 50.61,21.53 IC5.1
  Bottom 0.152: RN4.1 50.35,21.15 v50.61,20.89
LS14  (via drill 0.35 pad 0.25)
  Top 0.152: IC5.2 51.12,24.13 49.62,22.64 v49.62,20.89 49.62,19.02 48.83,18.22 48.83,17.21 49.06,16.98 U4.35
  Bottom 0.152: RN4.2 49.55,20.97 v49.62,20.89
LS15  (via drill 0.35 pad 0.25)
  Top 0.152: U4.36 48.98,16.17 48.13,17.02 48.13,18.54 48.64,19.05 v48.64,20.89 48.64,23.24 47.75,24.13 IC5.13
  Bottom 0.152: RN4.3 48.75,21 v48.64,20.89
LS16  (via drill 0.35 pad 0.25)
  Top 0.152: U4.40 49.02,12.99 47.66,14.34 v47.66,20.89 47.66,21.94 IC5.14
  Bottom 0.152: RN4.4 47.95,21.18 v47.66,20.89
MISO
  Top 0.152: R7.2 59.32,2.54 54.48,2.54 53.87,1.93 52.3,1.93 51.69,2.54 51.69,3.56 52.83,4.7 SPI.1 52.43,5.99 U4.2
MOSI
  Top 0.152: U4.1 51.64,4.39 SPI.4 51.78,1.56 59.41,1.56 R8.2
MRX  (via drill 0.35)
  Top 0.152: U4.9 57.89,8.16 v57.89,9.4
  Top 0.203: Q2.3 v39.12,25.34 R11.1
  Bottom 0.152: v57.89,9.4 57.51,9.78 56.52,9.78 48.5,17.79 45.59,17.79 42.18,21.21 42.18,22.28 v39.12,25.34
MTX  (via drill 0.35)
  Top 0.152: v58.8,9.4 58.83,9.37 U4.10
  Top 0.203: R13.1 42.36,24.89 43.37,23.88 v43.37,23.69 43.31,23.74 R14.1
  Bottom 0.152: v58.8,9.4 57.98,10.22 56.8,10.22 47.71,19.31 45.19,19.31 43.37,21.13 v43.37,23.69
N$1  (via drill 0.35)
  Top 0.152: U4.8 57.28,7.99 57.28,6.65 57.62,6.31 57.63,6.3 | 57.63,6.3 57.75,6.18 | Q1.CRST1 57.63,6.3
  Top 0.254: 57.75,6.18 58.41,6.18 v59.2,5.4
  Bottom 0.254: v59.2,5.4 59.13,5.4 58.41,4.67 C1.1
N$2  (via drill 0.35)
  Top 0.152: U4.7 56.41,7.42 56.6,7.23 56.6,5.32 56.18,4.9 55.79,4.9 Q1.CRST2 55.66,4.7 55.71,4.74
  Top 0.254: v55.5,3.43 55.52,3.44 55.52,4.55 55.71,4.74
  Bottom 0.254: v55.5,3.43 55.5,4.61 C2.1
N$4  (via drill 0.35)
  Top 0.61: v69.53,34.48 69.51,34.51 J1.18
  Bottom 0.61: Q4.3 69.13,33.66 69.53,34.06 v69.53,34.48
N$7
  Bottom 0.152: R2.2 64.42,32.7 Q4.1
N$8  (via drill 0.35)
  Top 0.406: R1.2 35.98,11.05 v34.8,11.05
  Bottom 0.406: v34.8,11.05 34.79,11.06 HC-06.24
N$9
  Top 0.203: Q2.1 38.17,24.51 38.04,24.38 R10.1
N$10
  Top 0.203: LED4.C 42.06,22.74 R14.2
N$11
  Top 0.203: R9.2 40.2,21.94 LED3.C
N$12
  Top 0.406: LED5.A R1.1
PWMA
  Top 0.152: U5.23 63.88,10.19 63.62,10.45 62.45,10.45 62.32,10.58 U4.13
PWMB  (via drill 0.35)
  Top 0.152: U4.14 62.71,11.39 v62.93,11.18 | v67.6,15.28 U5.15
  Bottom 0.152: v62.93,11.18 62.93,14.79 63.41,15.28 v67.6,15.28
RST  (via drill 0.35)
  Top 0.152: U4.4 54.03,9.21 v53.9,9.34 53.84,9.4 51.05,9.4 49.91,8.25 49.91,7.11 48.39,5.59 SPI.5
  Bottom 0.152: v53.9,9.34 53.86,9.3 R4.1
SCK
  Top 0.152: SPI.3 50.29,8.13 51.24,9.08 52.89,9.08 53.24,8.74 U4.3
SRX  (via drill 0.35)
  Top 0.203: R13.2 v44.39,24.95 R12.1
  Bottom 0.203: HC-06.2 44.78,24.56 v44.39,24.95
STX  (via drill 0.35)
  Top 0.203: R9.1 40.2,24.38 40.07,24.51 Q2.2 40.78,26.07 v44.39,26.07
  Bottom 0.203: v44.39,26.07 v44.39,26.06 HC-06.1
VREF
  Top 0.152: IC5.8 47.75,30.48 48.01,30.73 48.7,30.73 49.72,29.72 49.72,29.08 | 49.72,29.08 49.72,28.32 51.37,26.67 IC5.4 52,26.73 52.96,26.73 54.17,27.94 | 52.89,29.21 54.17,27.94 | 49.72,29.08 48.64,29.08 47.5,27.94 IC5.10 | IC4.8 56.52,30.48 57.98,29.02 57.98,28.96 | 57.98,28.96 57.98,28.32 59.63,26.67 IC4.4 61.02,26.67 62.29,27.94 | 57.98,28.96 56.77,28.96 55.76,27.94 IC4.10 54.17,27.94 | 62.29,27.94 61.02,29.21 IC4.6 | IC3.8 64.01,30.48 65.41,29.08 | 65.41,29.08 67.82,26.67 IC3.4 69.41,26.67 70.67,27.94 IC2.10 | 62.29,27.94 IC3.10 64.01,27.94 65.15,29.08 65.41,29.08 | IC2.8 73.09,30.48 74.36,29.21 | 74.36,29.21 74.74,28.83 74.74,27.88 75.95,26.67 IC2.4 77.66,26.67 78.17,27.18 78.17,28.7 77.66,29.21 IC2.6 | 74.36,29.21 73.54,29.21 72.27,27.94 IC2.10 | IC2.10 70.55,27.94 69.28,29.21 IC3.6
  Top 0.305: IC5.6 52.89,29.21
  Top 0.406: IC2.4 80.33,26.67 80.49,26.51 R3.2 84.28,23.45 C18.1

### Text on the board
tNames: STX | SRX | BT | + | -
bNames: Dominik Workshop | Line Follower V1.1 | 03.2022